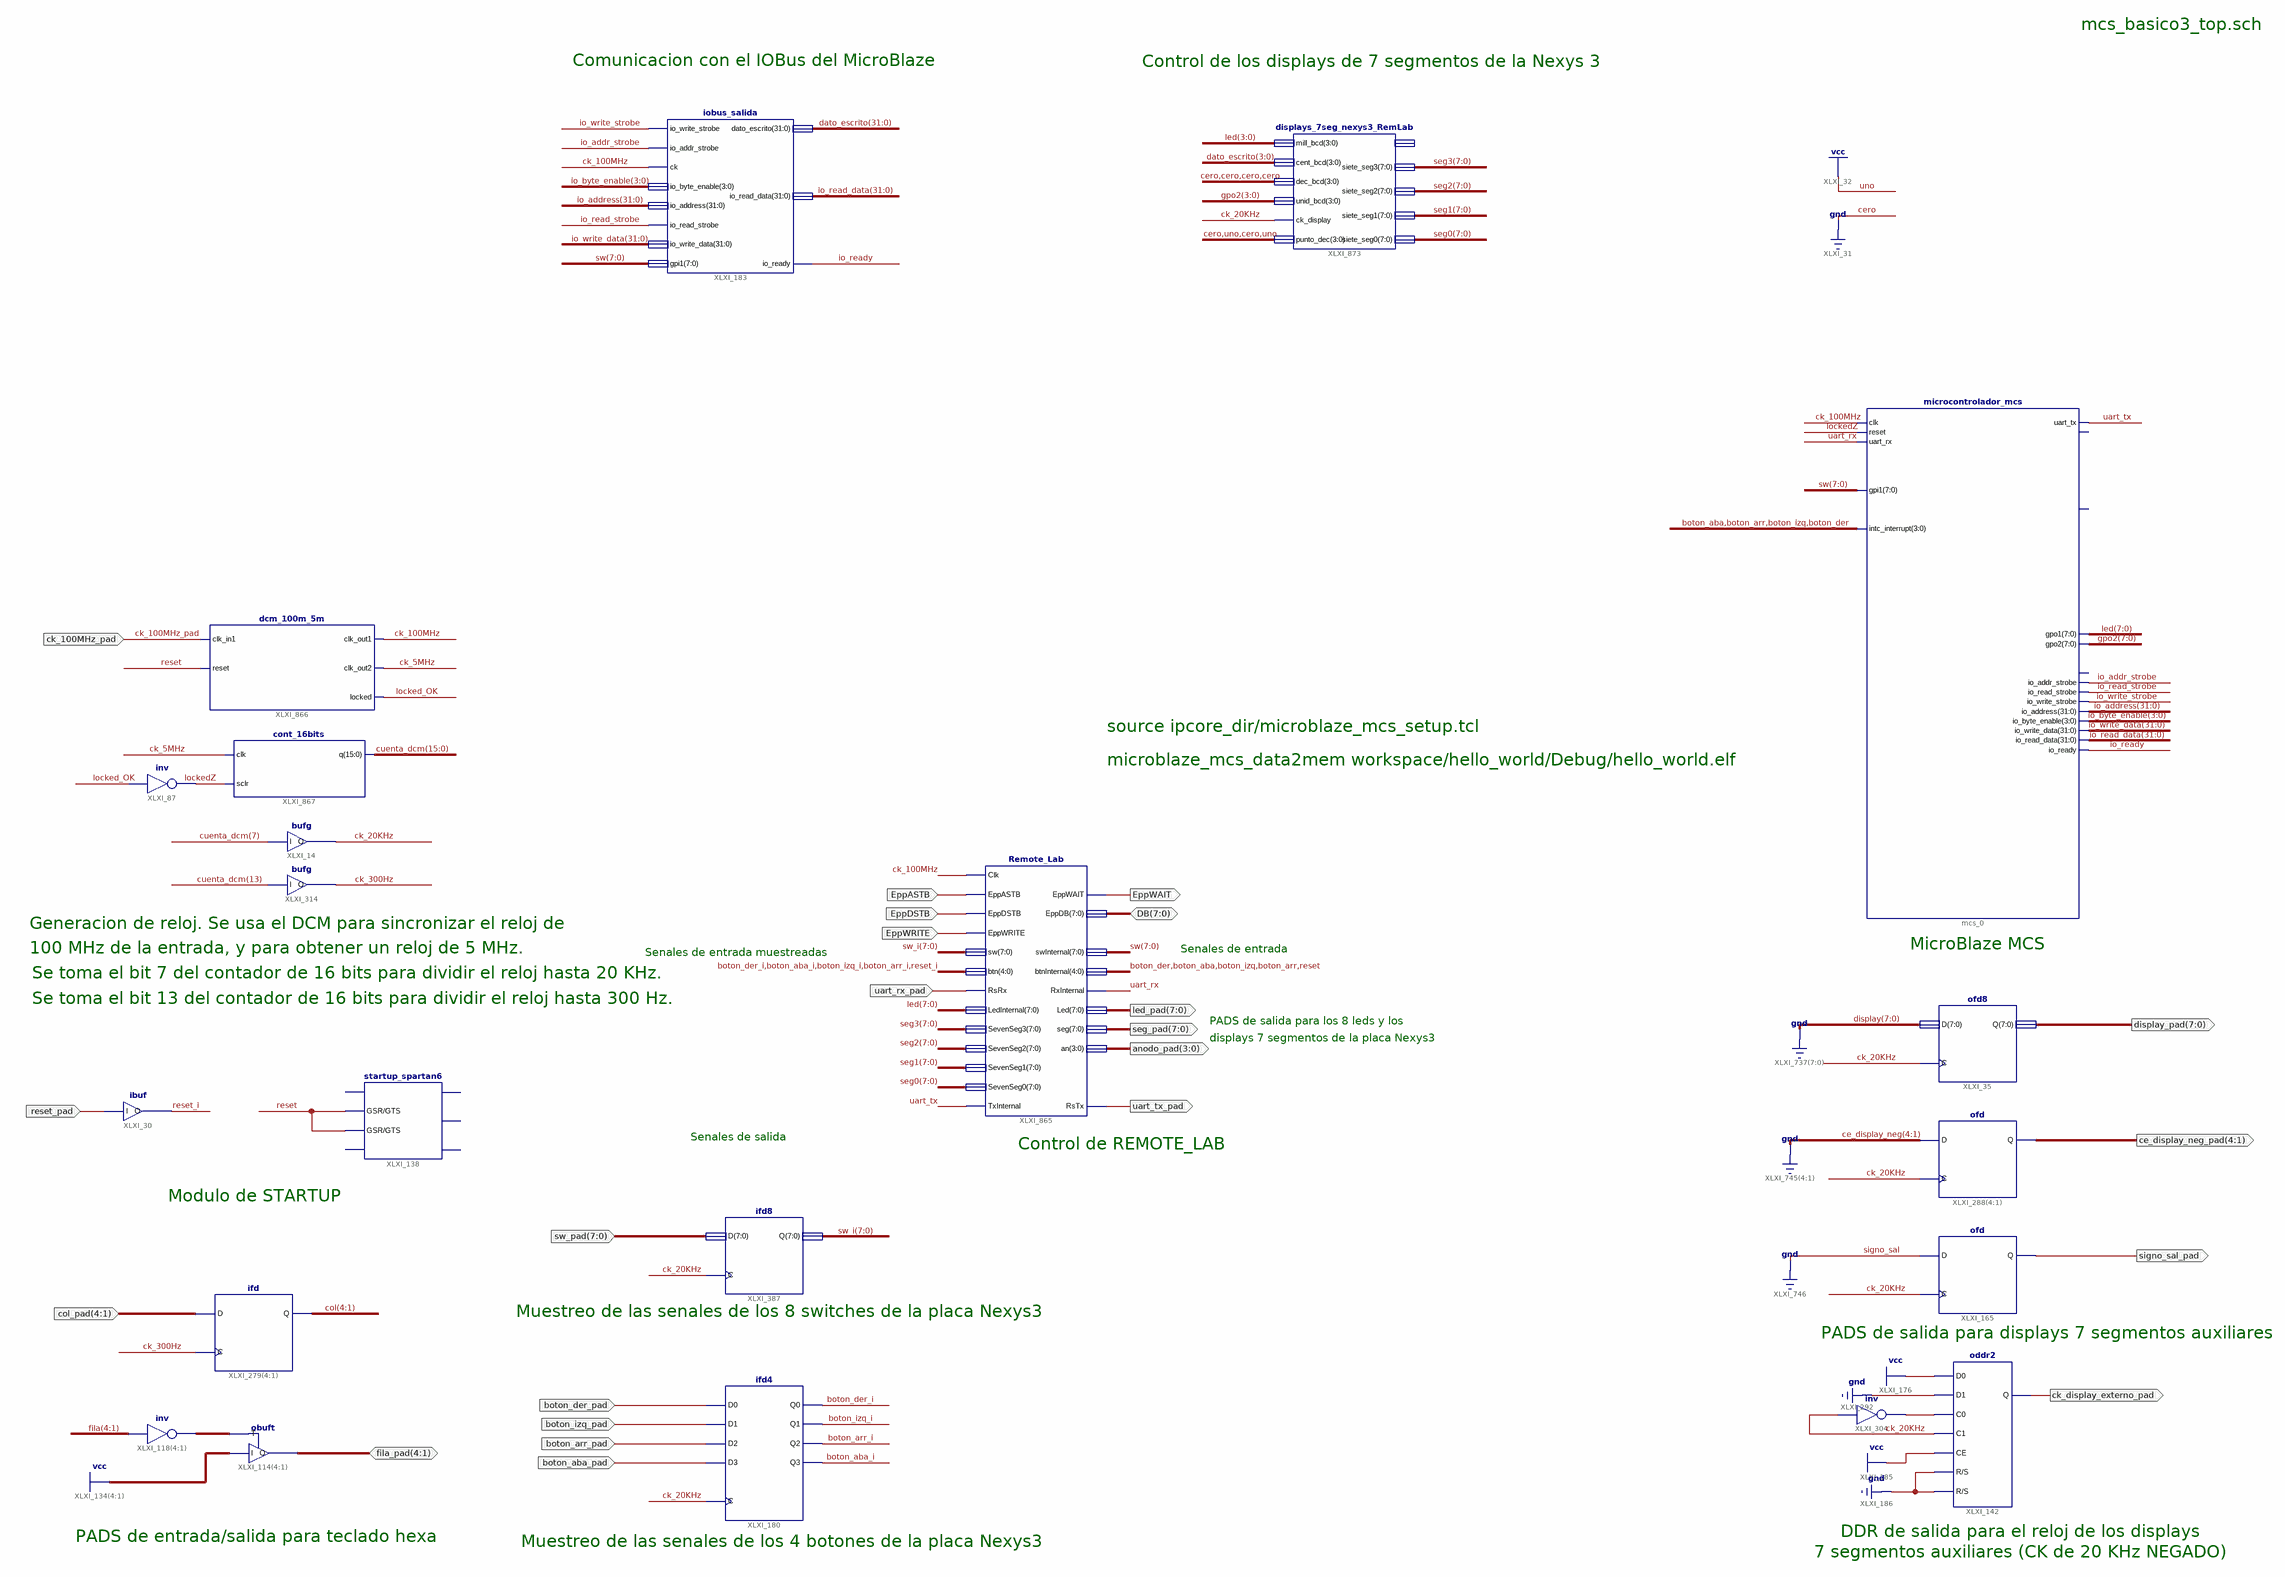
[diagram p0: schematic sheet 1]
// Xilinx ISE schematic mcs_basico3_top.sch (spartan6) as structural Verilog: 21 symbols, 23 ports
module mcs_basico3_top (
  input  [4:1] col_pad,
  input  reset_pad,
  input  ck_100MHz_pad,
  input  boton_der_pad,
  input  boton_izq_pad,
  input  boton_arr_pad,
  input  boton_aba_pad,
  input  [7:0] sw_pad,
  input  EppASTB,
  input  EppDSTB,
  input  EppWRITE,
  input  uart_rx_pad,
  inout  [4:1] fila_pad,
  inout  [7:0] DB,
  output [7:0] display_pad,
  output [4:1] ce_display_neg_pad,
  output signo_sal_pad,
  output ck_display_externo_pad,
  output EppWAIT,
  output [7:0] led_pad,
  output [7:0] seg_pad,
  output [3:0] anodo_pad,
  output uart_tx_pad
);

  wire boton_aba, boton_aba_i, boton_arr, boton_arr_i, boton_der, boton_der_i, boton_izq, boton_izq_i,
       ck_5MHz, ck_20KHz, ck_100MHz, ck_300Hz, io_addr_strobe, io_read_strobe, io_ready, io_write_strobe,
       locked_OK, lockedZ, reset, reset_i, uart_rx, uart_tx, XLXN_460;
  wire [3:0] io_byte_enable;
  wire [4:1] col, fila, XLXN_407;
  wire [7:0] gpo2, led, seg0, seg1, seg2, seg3, sw, sw_i;
  wire [15:0] cuenta_dcm;
  wire [31:0] dato_escrito, io_address, io_read_data, io_write_data;

  obuft XLXI_114[4:1] (.I(4'b1111), .T(XLXN_407), .O(fila_pad));
  assign XLXN_407 = ~fila;  // inv XLXI_118[4..1], 4 bits wide
  ifd XLXI_279[4:1] (.C(ck_300Hz), .D(col_pad), .Q(col));
  ibuf XLXI_30 (.I(reset_pad), .O(reset_i));
  startup_spartan6 XLXI_138 (.GSR(reset), .GTS(reset));  // open: CLK, KEYCLEARB, CFGCLK, CFGMCLK, EOS
  not XLXI_87 (lockedZ, locked_OK);
  bufg XLXI_14 (.I(cuenta_dcm[7]), .O(ck_20KHz));
  bufg XLXI_314 (.I(cuenta_dcm[13]), .O(ck_300Hz));
  ofd XLXI_288[4:1] (.C(ck_20KHz), .D(4'b0000), .Q(ce_display_neg_pad));
  ofd XLXI_165 (.C(ck_20KHz), .D(1'b0), .Q(signo_sal_pad));
  oddr2 XLXI_142 (
    .D0(1'b1), .D1(1'b0), .C0(XLXN_460), .C1(ck_20KHz), .CE(1'b1), .R(1'b0), .Q(ck_display_externo_pad),
    .S(1'b0));
  not XLXI_304 (XLXN_460, ck_20KHz);
  ofd8 XLXI_35 (.C(ck_20KHz), .D({8{1'b0}}), .Q(display_pad));
  ifd4 XLXI_180 (
    .C(ck_20KHz), .D0(boton_der_pad), .D1(boton_izq_pad), .D2(boton_arr_pad), .D3(boton_aba_pad),
    .Q0(boton_der_i), .Q1(boton_izq_i), .Q2(boton_arr_i), .Q3(boton_aba_i));
  ifd8 XLXI_387 (.C(ck_20KHz), .D(sw_pad), .Q(sw_i));
  Remote_Lab XLXI_865 (
    .Clk(ck_100MHz), .EppASTB(EppASTB), .EppDSTB(EppDSTB), .EppWRITE(EppWRITE), .RsRx(uart_rx_pad),
    .TxInternal(uart_tx), .sw(sw_i), .btn({boton_der_i, boton_aba_i, boton_izq_i, boton_arr_i, reset_i}),
    .LedInternal(led), .SevenSeg3(seg3), .SevenSeg2(seg2), .SevenSeg1(seg1), .SevenSeg0(seg0), .EppDB(DB),
    .EppWAIT(EppWAIT), .RxInternal(uart_rx), .RsTx(uart_tx_pad), .swInternal(sw),
    .btnInternal({boton_der, boton_aba, boton_izq, boton_arr, reset}), .Led(led_pad), .seg(seg_pad),
    .an(anodo_pad));
  dcm_100m_5m XLXI_866 (
    .clk_in1(ck_100MHz_pad), .clk_out1(ck_100MHz), .clk_out2(ck_5MHz), .reset(reset), .locked(locked_OK));
  cont_16bits XLXI_867 (.clk(ck_5MHz), .sclr(lockedZ), .q(cuenta_dcm));
  microcontrolador_mcs mcs_0 (
    .clk(ck_100MHz), .reset(lockedZ), .uart_tx(uart_tx), .uart_rx(uart_rx), .gpi1(sw), .gpo1(led),
    .gpo2(gpo2), .intc_interrupt({boton_aba, boton_arr, boton_izq, boton_der}),
    .io_addr_strobe(io_addr_strobe), .io_read_strobe(io_read_strobe), .io_write_strobe(io_write_strobe),
    .io_address(io_address), .io_byte_enable(io_byte_enable), .io_write_data(io_write_data),
    .io_read_data(io_read_data), .io_ready(io_ready));  // open: fit1_toggle, fit1_interrupt, intc_irq
  iobus_salida XLXI_183 (
    .io_write_strobe(io_write_strobe), .io_addr_strobe(io_addr_strobe), .ck(ck_100MHz),
    .io_byte_enable(io_byte_enable), .io_address(io_address), .io_read_strobe(io_read_strobe),
    .io_write_data(io_write_data), .gpi1(sw), .dato_escrito(dato_escrito), .io_read_data(io_read_data),
    .io_ready(io_ready));
  displays_7seg_nexys3_RemLab XLXI_873 (
    .mill_bcd(led[3:0]), .cent_bcd(dato_escrito[3:0]), .dec_bcd(4'b0000), .unid_bcd(gpo2[3:0]),
    .ck_display(ck_20KHz), .punto_dec(4'b0101), .siete_seg3(seg3), .siete_seg2(seg2), .siete_seg1(seg1),
    .siete_seg0(seg0));  // open: anodo

  // Notes on the sheet:
  //   mcs_basico3_top.sch
  //   Comunicacion con el IOBus del MicroBlaze
  //   Control de los displays de 7 segmentos de la Nexys 3
  //   source ipcore_dir/microblaze_mcs_setup.tcl
  //   microblaze_mcs_data2mem workspace/hello_world/Debug/hello_world.elf
  //   Generacion de reloj. Se usa el DCM para sincronizar el reloj de
  //   MicroBlaze MCS
  //   100 MHz de la entrada, y para obtener un reloj de 5 MHz.
  //   Senales de entrada
  //   Senales de entrada muestreadas
  //   Se toma el bit 7 del contador de 16 bits para dividir el reloj hasta 20 KHz.
  //   Se toma el bit 13 del contador de 16 bits para dividir el reloj hasta 300 Hz.
  //   PADS de salida para los 8 leds y los
  //   displays 7 segmentos de la placa Nexys3
  //   Senales de salida
  //   Control de REMOTE_LAB
  //   Modulo de STARTUP
  //   Muestreo de las senales de los 8 switches de la placa Nexys3
  //   PADS de salida para displays 7 segmentos auxiliares
  //   DDR de salida para el reloj de los displays
  //   PADS de entrada/salida para teclado hexa
  //   Muestreo de las senales de los 4 botones de la placa Nexys3
  //   7 segmentos auxiliares (CK de 20 KHz NEGADO)
endmodule
